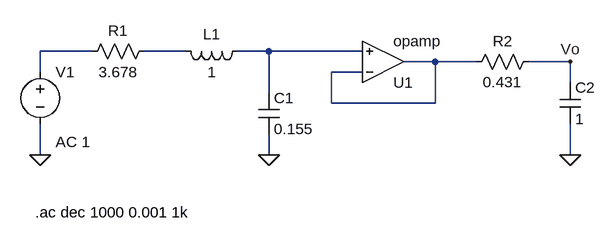
[diagram p0: schematic circuito.asc]
circuito.asc, the LTspice schematic file:
Version 4.1
SHEET 1 880 680
WIRE 48 128 -32 128
WIRE 192 128 128 128
WIRE 320 128 272 128
WIRE 464 128 320 128
WIRE 576 144 528 144
WIRE 640 144 576 144
WIRE 784 144 720 144
WIRE -32 160 -32 128
WIRE 464 160 416 160
WIRE 784 176 784 144
WIRE 320 192 320 128
WIRE 416 208 416 160
WIRE 576 208 576 144
WIRE 576 208 416 208
WIRE -32 288 -32 240
WIRE 320 288 320 256
WIRE 784 288 784 240
FLAG -32 288 0
FLAG 320 288 0
FLAG 784 288 0
FLAG 784 144 Vo
SYMBOL res 144 112 R90
WINDOW 0 0 56 VBottom 2
WINDOW 3 32 56 VTop 2
SYMATTR InstName R1
SYMATTR Value 3.678
SYMBOL ind 288 112 R90
WINDOW 0 5 56 VBottom 2
WINDOW 3 32 56 VTop 2
SYMATTR InstName L1
SYMATTR Value 1
SYMATTR SpiceLine Rser=1m
SYMBOL cap 304 192 R0
SYMATTR InstName C1
SYMATTR Value 0.155
SYMBOL voltage -32 144 R0
WINDOW 123 24 124 Left 2
WINDOW 39 0 0 Left 0
SYMATTR InstName V1
SYMATTR Value ""
SYMATTR Value2 AC 1
SYMBOL OpAmps\\opamp 496 208 M180
SYMATTR InstName U1
SYMBOL res 736 128 R90
WINDOW 0 0 56 VBottom 2
WINDOW 3 32 56 VTop 2
SYMATTR InstName R2
SYMATTR Value 0.431
SYMBOL cap 768 176 R0
SYMATTR InstName C2
SYMATTR Value 1
TEXT -40 376 Left 2 !.ac dec 1000 0.001 1k

The netlist it stands for:
* circuito.asc
R1 N002 N001 3.678
L1 N003 N002 1 Rser=1m
C1 N003 0 0.155
V1 N001 0 AC 1
X§U1 N004 N003 N004 opamp Aol=100K GBW=10Meg  ; pins invin noninvin out
R2 Vo N004 0.431
C2 Vo 0 1
.ac dec 1000 0.001 1k
.backanno
.end